# EAGLE design Balancer (EAGLE 6.2)
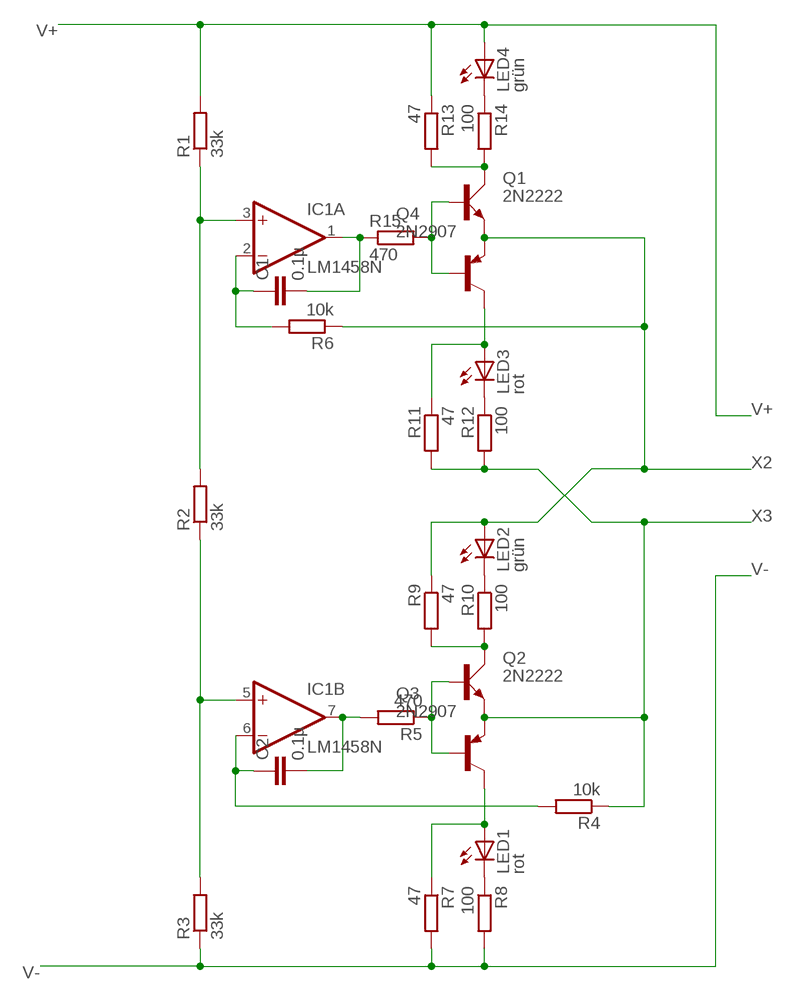
[diagram p0: schematic, sheet 1]

## Parts
C1  0.1µ  C-EU050-025X075  [C050-025X075]
C2  0.1µ  C-EU050-025X075  [C050-025X075]
IC1  LM1458N  [DIL08]
LED1  rot  LED5MM  [LED5MM]
LED2  grün  LED5MM  [LED5MM]
LED3  rot  LED5MM  [LED5MM]
LED4  grün  LED5MM  [LED5MM]
Q1  2N2222  [TO18A]
Q2  2N2222  [TO18A]
Q3  2N2907  [TO18]
Q4  2N2907  [TO18]
R1  33k  R-EU_0204/5  [0204/5]
R2  33k  R-EU_0204/5  [0204/5]
R3  33k  R-EU_0204/5  [0204/5]
R4  10k  R-EU_0204/5  [0204/5]
R5  470  R-EU_0204/5  [0204/5]
R6  10k  R-EU_0204/5  [0204/5]
R7  47  R-EU_0204/5  [0204/5]
R8  100  R-EU_0204/5  [0204/5]
R9  47  R-EU_0204/5  [0204/5]
R10  100  R-EU_0204/5  [0204/5]
R11  47  R-EU_0204/5  [0204/5]
R12  100  R-EU_0204/5  [0204/5]
R13  47  R-EU_0204/5  [0204/5]
R14  100  R-EU_0204/5  [0204/5]
R15  470  R-EU_0204/5  [0204/5]

## Nets
N$1: C1.2 IC1.1(A:OUT) R15.1
N$2: LED4.K(C) R14.1
N$3: Q1.C R13.2 R14.2
N$5: LED3.K(C) R12.1
N$6: LED2.K(C) R10.1
N$7: Q2.C R9.2 R10.2
N$9: LED1.K(C) R8.1
N$10: IC1.5(B:+IN) R2.1 R3.2
N$11: IC1.3(A:+IN) R1.1 R2.2
N$12: C1.1 IC1.2(A:-IN) R6.2
N$14: LED3.A Q4.3(C) R11.1
N$17: Q1.B Q4.2(B) R15.2
N$18: Q2.B Q3.2(B) R5.1
N$19: C2.2 IC1.7(B:OUT) R5.2
N$20: C2.1 IC1.6(B:-IN) R4.2
N$21: LED1.A Q3.3(C) R7.1
V+: LED4.A R1.2 R13.1
V-: R3.1 R7.2 R8.2
X2: LED2.A Q1.E Q4.1(E) R6.1 R9.1
X3: Q2.E Q3.1(E) R4.1 R11.2 R12.2

## Power pins joined to a net without a drawn wire
V+: IC1.8(P:V+)
V-: IC1.4(P:V-)

## Library data of the parts
C1 C2 = rcl:C-EU: CAPACITOR, European symbol
IC1 = linear:*1458: OP AMP
LED1-LED4 = led:LED: LED OSRAM: - CHIPLED LG R971, LG N971, LY N971, LG Q971, LY Q971, LO R971, LY R971 LH N974, LH R974 LS Q976, LO Q976, LY Q976 LO Q996 - Hyper CHIPLED LW Q18S LB Q993, LB Q99A, LB R99A - SideLED LS A670, LO A670, LY A670, LG A670, LP A670 LB A673, LV A673, LT A673, LW A673 LH A674 LY A675 LS A676, LA A676, LO A676, LY A676, LW A676 LS A679, LY A679, LG A679 - Hyper Micro SIDELED® LS Y876, LA Y876, LO Y876, LY Y876 LT Y87S - SmartLED LW L88C, LW L88S LB L89C, LB L89S, LG L890 LS L89K, LO L89K, LY L89K LS L896, LA L896, LO L896, LY L896 - TOPLED LS T670, LO T670, LY T670, LG T670, LP T670 LSG T670, LSP T670, LSY T670, LOP T670, LYG T670 LG T671, LOG T671, LSG T671 LB T673, LV T673, LT T673, LW T673 LH T674 LS T676, LA T676, LO T676, LY T676, LB T676, LH T676, LSB T676, LW T676 LB T67C, LV T67C, LT T67C, LS T67K, LO T67K, LY T67K, LW E67C LS E67B, LA E67B, LO E67B, LY E67B, LB E67C, LV E67C, LT E67C LW T67C LS T679, LY T679, LG T679 LS T770, LO T770, LY T770, LG T770, LP T770 LB T773, LV T773, LT T773, LW T773 LH T774 LS E675, LA E675, LY E675, LS T675 LS T776, LA T776, LO T776, LY T776, LB T776 LHGB T686 LT T68C, LB T68C - Hyper Mini TOPLED® LB M676 - Mini TOPLED Santana® LG M470 LS M47K, LO M47K, LY M47K Source: http://www.osram.convergy.de LUXEON: - LUMILED® LXK2-PW12-R00, LXK2-PW12-S00, LXK2-PW14-U00, LXK2-PW14-V00 LXK2-PM12-R00, LXK2-PM12-S00, LXK2-PM14-U00 LXK2-PE12-Q00, LXK2-PE12-R00, LXK2-PE12-S00, LXK2-PE14-T00, LXK2-PE14-U00 LXK2-PB12-K00, LXK2-PB12-L00, LXK2-PB12-M00, LXK2-PB14-N00, LXK2-PB14-P00, LXK2-PB14-Q00 LXK2-PR12-L00, LXK2-PR12-M00, LXK2-PR14-Q00, LXK2-PR14-R00 LXK2-PD12-Q00, LXK2-PD12-R00, LXK2-PD12-S00 LXK2-PH12-R00, LXK2-PH12-S00 LXK2-PL12-P00, LXK2-PL12-Q00, LXK2-PL12-R00 Source: www.luxeon.com KINGBRIGHT: KA-3528ASYC Source: www.kingbright.com
Q1 Q2 = transistor-small-signal:2N2222: NPN TRANSISTOR
Q3 Q4 = transistor-pnp:2N2907*: PNP Transistor
R1-R15 = rcl:R-EU_: RESISTOR, European symbol

## Board
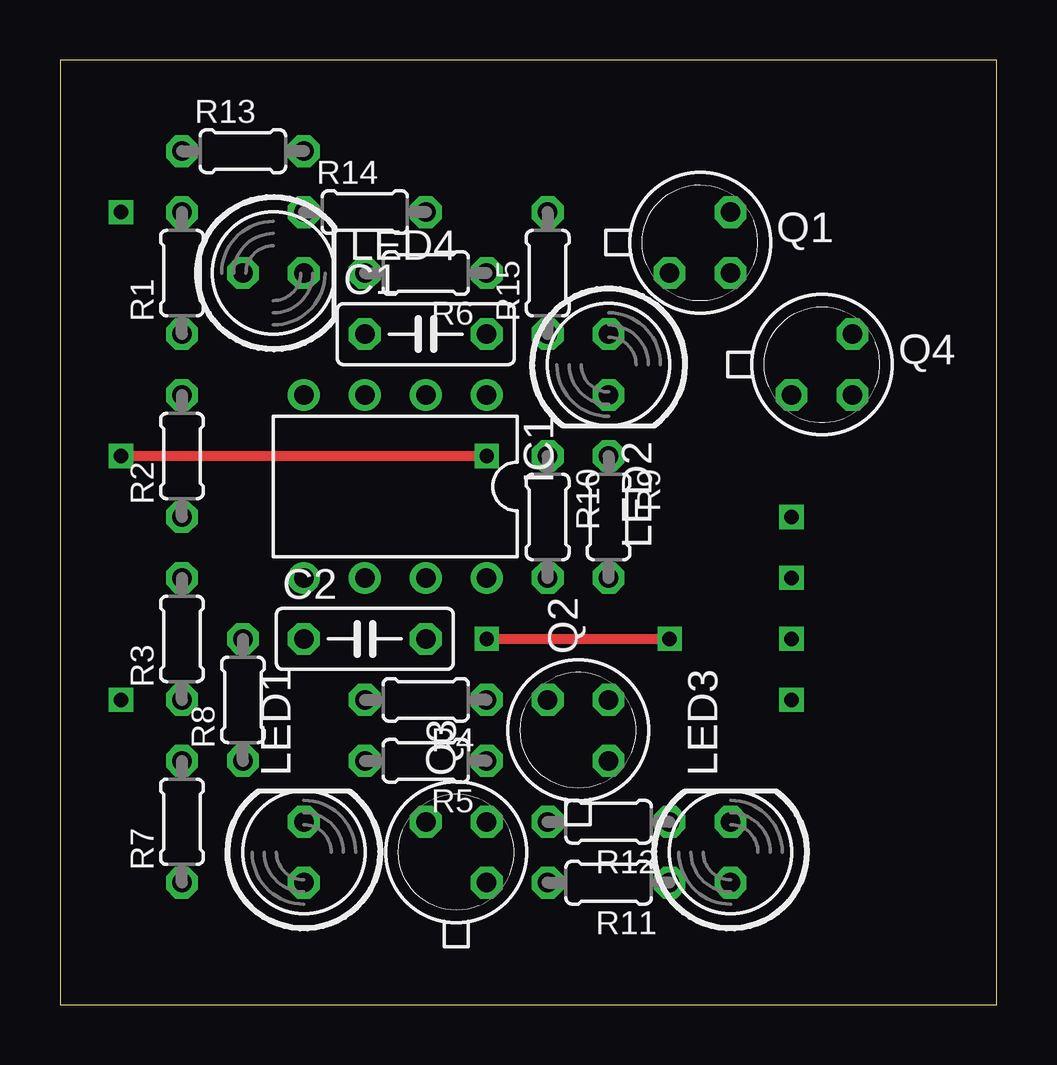
[diagram p1: board, top side]
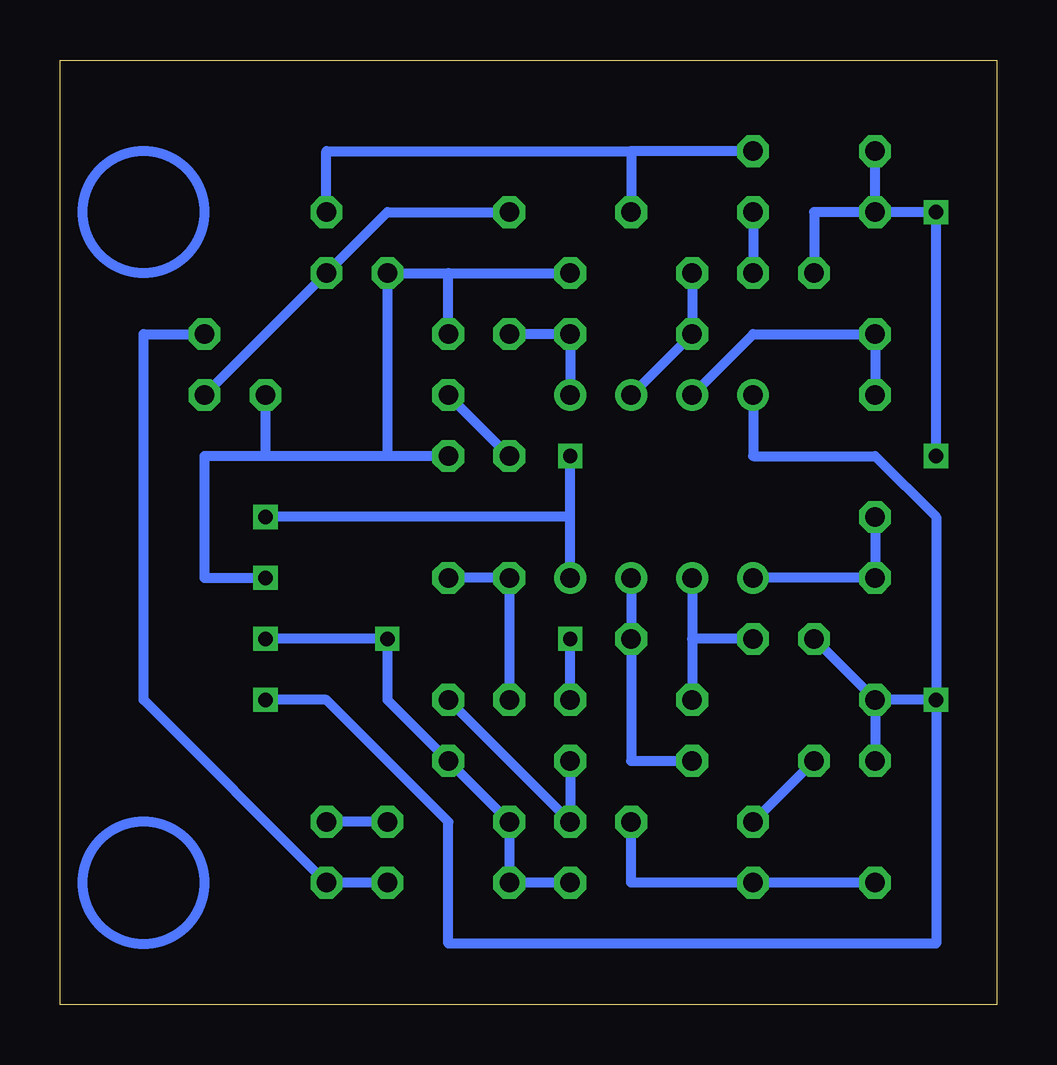
[diagram p2: board, bottom side, seen from below]

Size 39.04 x 39.36 mm. Coordinates in mm from the lower left corner, seen from the top.
Outline: 0,0 39.04,0 39.04,39.36 0,39.36 0,0
Copper layers (1*16): Top 0.035mm / dielectric 1.5mm / Bottom 0.035mm
Design rules "default": minimum track width 10mil, minimum drill 24mil, track to track 8mil, track to pad 8mil, pad to pad 8mil, via to via 8mil, smd to smd 8mil, copper to edge 40mil, drill to drill 8mil, minimum pad ring 10mil, minimum via ring 8mil, stop-mask expansion 4mil, vias tented up to drill 0mil, thermal gap 10mil

### Footprints (pad centres in the part's own frame; a part is rotated, then mirrored left to right if it is on the bottom)
C050-025X075 = drill 0.813 octagon: 1 -2.54,0; 2 2.54,0
DIL08 = drill 0.813 pad 1.27: 1 -3.81,-3.81; 2 -1.27,-3.81; 3 1.27,-3.81; 4 3.81,-3.81; 5 3.81,3.81; 6 1.27,3.81; 7 -1.27,3.81; 8 -3.81,3.81
LED5MM = drill 0.813 octagon: A -1.27,0; K 1.27,0
TO18A = drill 0.813 octagon: B 1.27,-1.27; C 1.27,1.27; E -1.27,-1.27
TO18 = drill 0.813 octagon: 1 -1.27,-1.27; 2 1.27,-1.27; 3 1.27,1.27
0204/5 = drill 0.813 octagon: 1 -2.54,0; 2 2.54,0

### Placement (x,y rotation side)
C1  15.24,27.94 0 top
C2  12.7,15.24 0 top
IC1  13.97,21.59 180 top
LED1  10.16,6.35 90 top
LED2  22.86,26.67 270 top
LED3  27.94,6.35 90 top
LED4  8.89,30.48 0 top
Q1  26.67,31.75 0 top
Q2  21.59,11.43 90 top
Q3  16.51,6.35 90 top
Q4  31.75,26.67 0 top
R1  5.08,30.48 90 top
R2  5.08,22.86 90 top
R3  5.08,15.24 90 top
R4  15.24,12.7 180 top
R5  15.24,10.16 180 top
R6  15.24,30.48 180 top
R7  5.08,7.62 90 top
R8  7.62,12.7 90 top
R9  22.86,20.32 270 top
R10  20.32,20.32 270 top
R11  22.86,5.08 180 top
R12  22.86,7.62 180 top
R13  7.62,35.56 0 top
R14  12.7,33.02 0 top
R15  20.32,30.48 90 top

### Tracks (layer width: path | path; a pad name or v marks a point on that pad's centre or on a via)
N$1
  Bottom 0.406: IC1.1 C1.2 R15.1
N$2
  Bottom 0.406: R14.1 LED4.K
N$3
  Bottom 0.406: R13.2 15.24,35.56 | 15.24,35.56 R14.2 | Q1.C 27.94,35.56 15.24,35.56
N$4  (via drill 0.6)
  other vias: 2.54,33.02
N$5
  Bottom 0.406: R12.1 LED3.K
N$6
  Bottom 0.406: LED2.K R10.1
N$7
  Bottom 0.406: Q2.C R10.2 R9.2
N$8  (via drill 0.6)
  other vias: 2.54,12.7
N$9
  Bottom 0.406: R8.1 LED1.K
N$10
  Bottom 0.406: R2.1 R3.2 IC1.5
N$11
  Bottom 0.406: R2.2 R1.1 10.16,27.94 IC1.3
N$12
  Bottom 0.406: R6.2 C1.1 IC1.2
N$14
  Bottom 0.406: R11.1 LED3.A 35.56,12.7 35.56,27.94 Q4.3
N$17
  Bottom 0.406: R15.2 25.4,33.02 Q1.B Q4.2
N$18
  Bottom 0.406: R5.1 Q3.2 Q2.B
N$19
  Bottom 0.406: IC1.7 C2.2 15.24,10.16 R5.2
N$20
  Bottom 0.406: IC1.6 12.7,15.24 | 12.7,15.24 R4.2 | C2.1 12.7,15.24
N$21
  Bottom 0.406: R7.1 LED1.A 15.24,5.08 Q3.3
V+  (via drill 0.6)
  Top 0.406: v17.78,22.86 v2.54,22.86
  Bottom 0.406: R1.2 R13.1 | R1.2 7.62,33.02 LED4.A | IC1.8 17.78,20.32 | 17.78,20.32 v17.78,22.86 | v2.54,22.86 2.54,33.02 R1.2 | 17.78,20.32 v30.48,20.32
V-  (via drill 0.6)
  Bottom 0.406: R8.2 R3.1 | R3.1 R7.2 | IC1.4 10.16,22.86 5.08,22.86 2.54,20.32 2.54,12.7 | 2.54,12.7 R3.1 | 2.54,12.7 2.54,2.54 22.86,2.54 22.86,7.62 27.94,12.7 v30.48,12.7
X2  (via drill 0.6)
  Bottom 0.406: LED2.A 22.86,30.48 | 22.86,30.48 R6.1 | 22.86,30.48 Q1.E 25.4,22.86 | R9.1 25.4,22.86 | 25.4,22.86 30.48,22.86 | 30.48,22.86 33.02,22.86 33.02,17.78 v30.48,17.78 | Q4.1 30.48,22.86
X3  (via drill 0.6)
  Top 0.406: v17.78,15.24 v25.4,15.24
  Bottom 0.406: R4.1 v17.78,15.24 | v30.48,15.24 v25.4,15.24 25.4,12.7 Q2.E R12.2 R11.2 Q3.1
(copper drawn outside any net)
  shapes: Bottom circle x2